# EasyEDA Pro project ProPrj_H750VB_2024-10-16.epro, schematic Schematic1
Board Name: Board1; Create Date: 2024-09-11
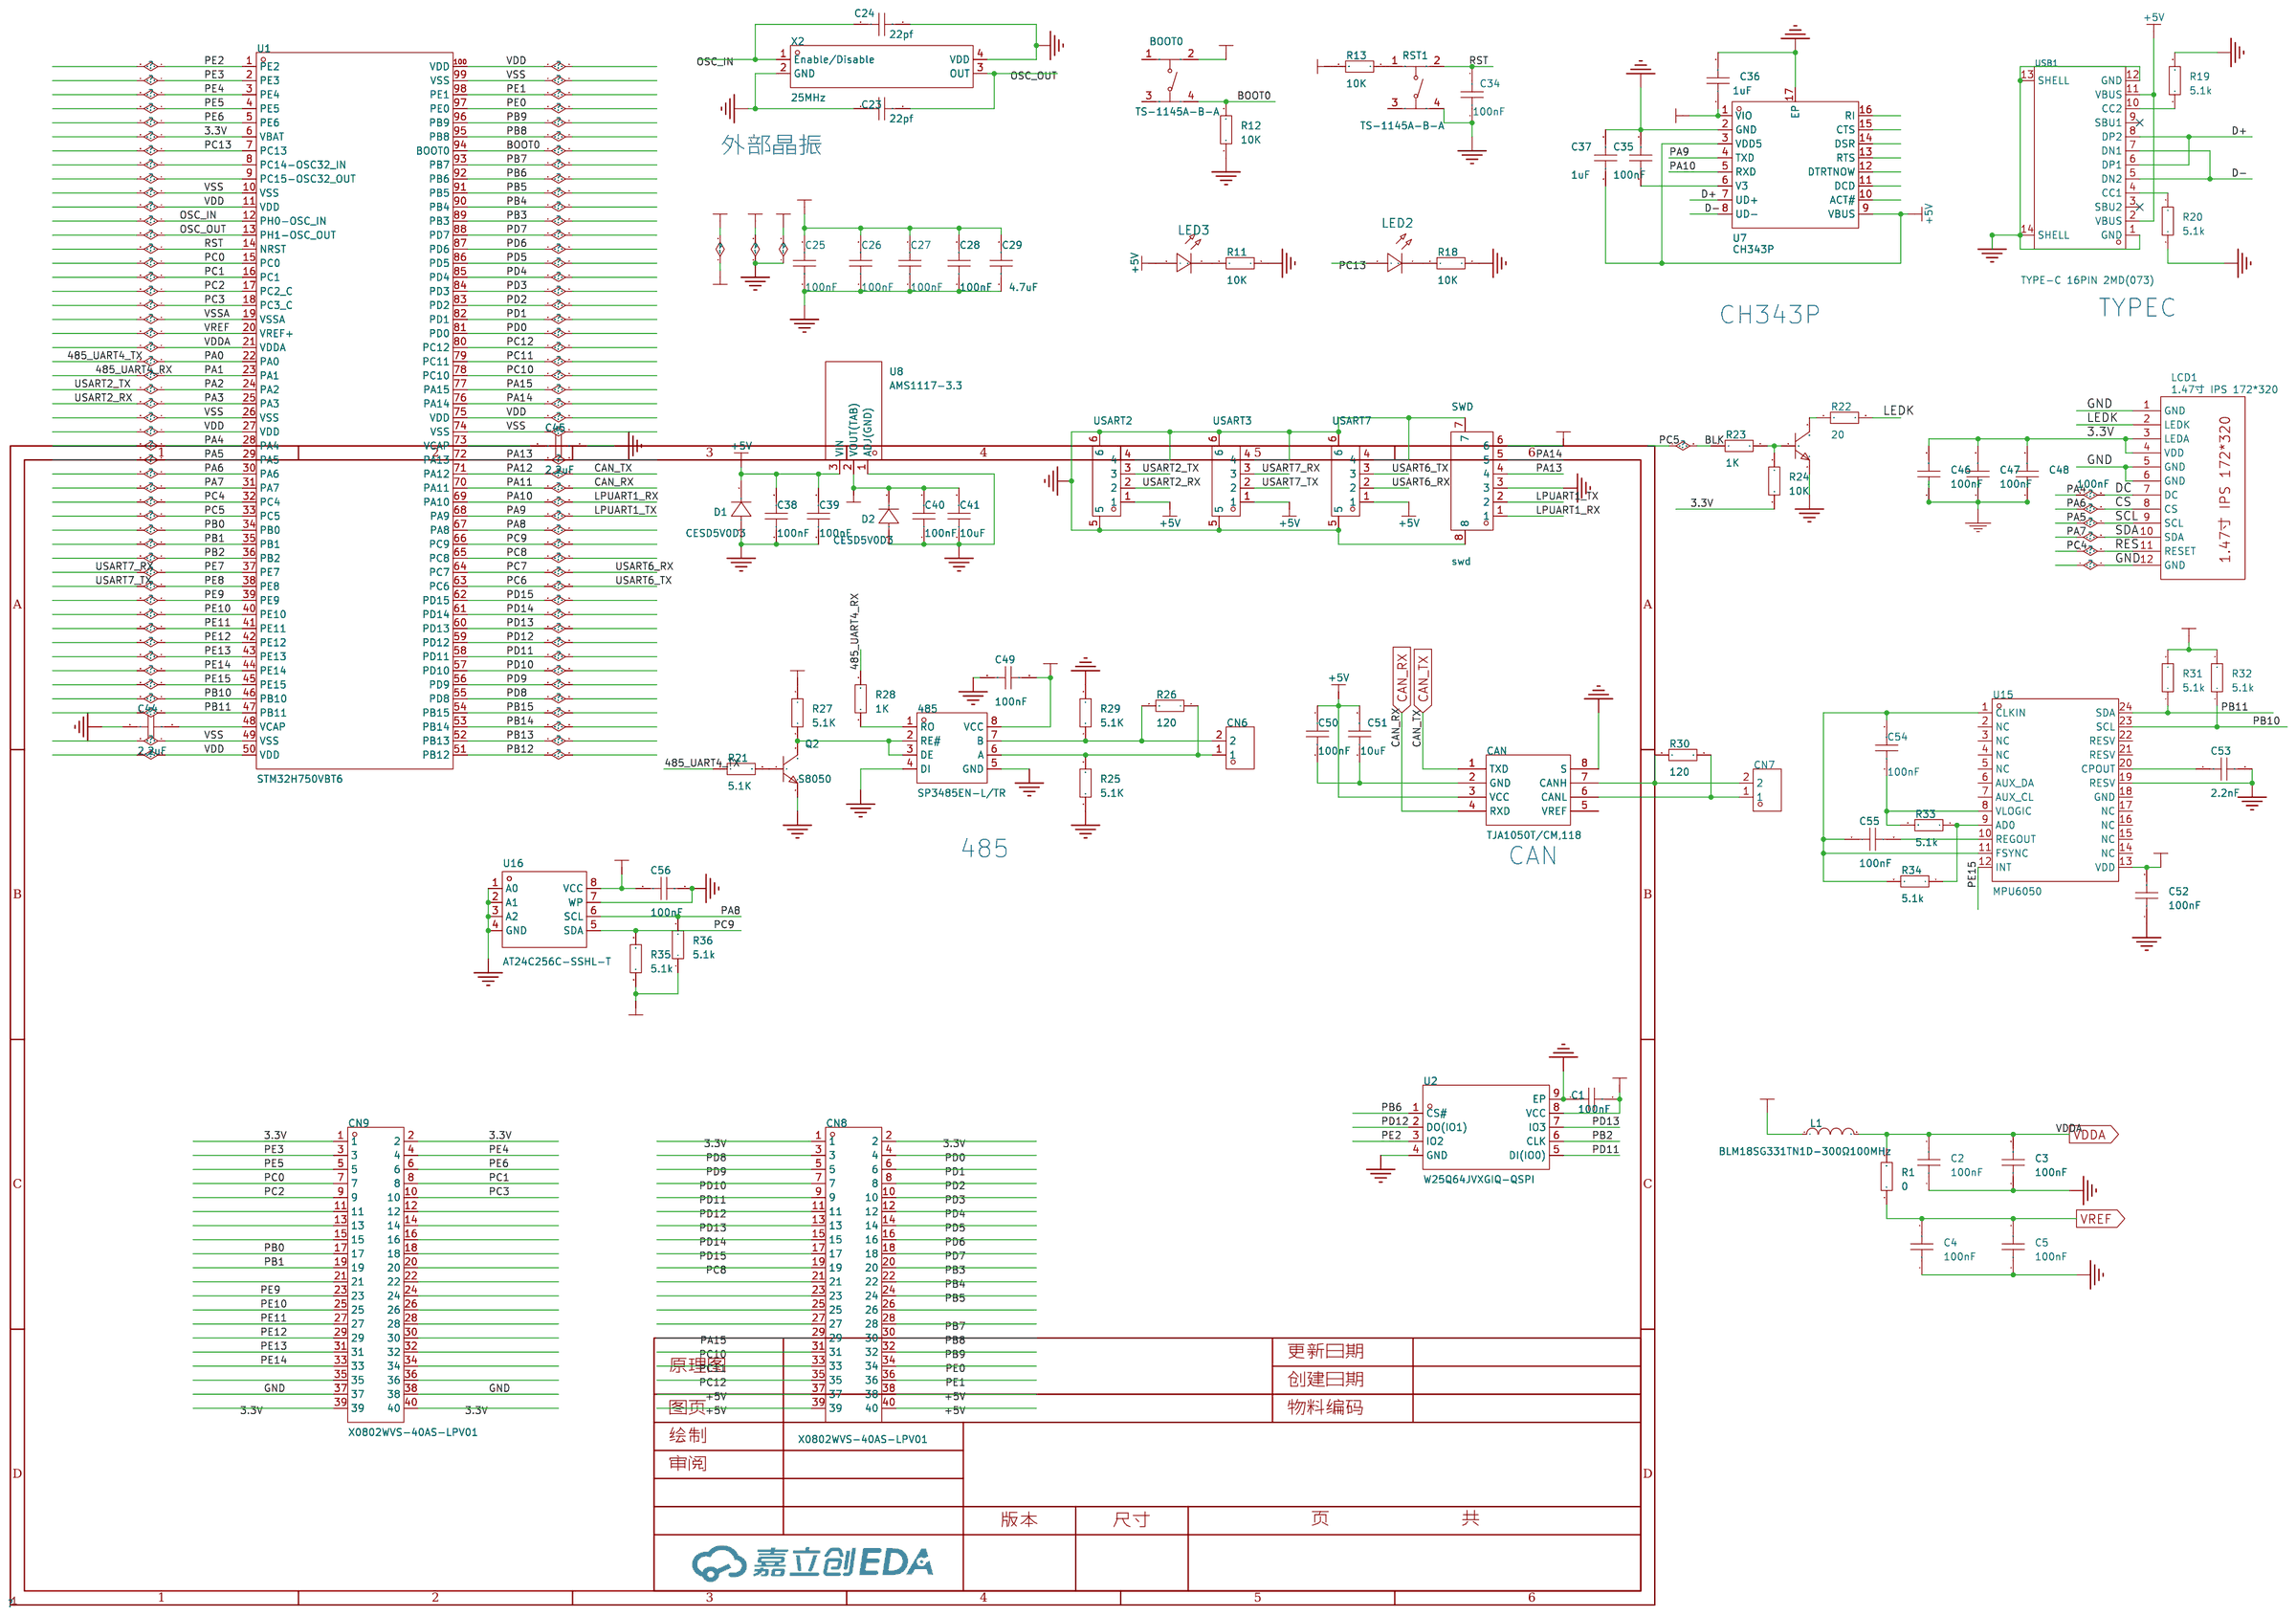
[diagram p0: schematic sheet]

## Parts
485  SP3485EN-L/TR  [SOIC-8_L5.0-W4.0-P1.27-LS6.0-BL]
BOOT0  TS-1145A-B-A  [SW-SMD_4P-L4.2-W3.2-P2.15-LS5.2]
C1  100nF  [C0603]
C2  100nF  [C0603]
C3  100nF  [C0603]
C4  100nF  [C0603]
C5  100nF  [C0603]
C23  22pf  [C0603]
C24  22pf  [C0603]
C25  100nF  [C0603]
C26  100nF  [C0603]
C27  100nF  [C0603]
C28  100nF  [C0603]
C29  4.7uF  [C0603]
C34  100nF  [C0603]
C35  100nF  [C0603]
C36  1uF  [C0603]
C37  1uF  [C0603]
C38  100nF  [C0603]
C39  100nF  [C0603]
C40  100nF  [C0603]
C41  10uF  [C0603]
C44  2.2uF  [C0603]
C45  2.2uF  [C0603]
C46  100nF  [C0603]
C47  100nF  [C0603]
C48  100nF  [C0603]
C49  100nF  [C0603]
C50  100nF  [C0603]
C51  10uF  [C0603]
C52  100nF  [C0603]
C53  2.2nF  [C0603]
C54  100nF  [C0603]
C55  100nF  [C0603]
C56  100nF  [C0603]
CAN  TJA1050T/CM,118  [SOIC-8_L5.0-W4.0-P1.27-LS6.0-BL]
CN6  ZX-XH2.54-2PZZ  [CONN-TH_2P-P2.50_HX25003-2A]
CN7  ZX-XH2.54-2PZZ  [CONN-TH_2P-P2.50_HX25003-2A]
CN8  X0802WVS-40AS-LPV01  [CONN-SMD_40P-P0.80_XKB_X0802WVS-40ADS-LPV01]
CN9  X0802WVS-40AS-LPV01  [CONN-SMD_40P-P0.80_XKB_X0802WVS-40ADS-LPV01]
D1  CESD5V0D3  [SOD-323_L1.7-W1.3-LS2.6-RD-2]
D2  CESD5V0D3  [SOD-323_L1.7-W1.3-LS2.6-RD-2]
L1  BLM18SG331TN1D-300Ω100MHz  [L0603]
LCD1  1.47寸 IPS 172*320  [1.47LCD-IPS-172*320-反面]
LED2  -  [LED_0603]
LED3  -  [LED_0603]
Q2  S8050  [SOT-23-3_L2.9-W1.6-P1.90-LS2.8-BR]
R1  0  [R0603]
R11  10K  [R0603]
R12  10K  [R0603]
R13  10K  [R0603]
R18  10K  [R0603]
R19  5.1k  [R0603]
R20  5.1k  [R0603]
R21  5.1K  [R0603]
R22  20  [R0603]
R23  1K  [R0603]
R24  10K  [R0603]
R25  5.1K  [R0603]
R26  120  [R0603]
R27  5.1K  [R0603]
R28  1K  [R0603]
R29  5.1K  [R0603]
R30  120  [R0603]
R31  5.1k  [R0603]
R32  5.1k  [R0603]
R33  5.1k  [R0603]
R34  5.1k  [R0603]
R35  5.1k  [R0603]
R36  5.1k  [R0603]
RST1  TS-1145A-B-A  [SW-SMD_4P-L4.2-W3.2-P2.15-LS5.2]
SWD  swd  [CONN-SMD_6P-P1.00_MEGASTAR_ZX-SH1.0-6PWT]
U1  STM32H750VBT6  [LQFP-100_L14.0-W14.0-P0.50-LS16.0-BL]
U2  W25Q64JVXGIQ-QSPI  [XSON-8_L4.0-W4.0-P0.80-TL-EP]
U7  CH343P  [TQFN-16_L3.0-W3.0-P0.50-BL-EP1.7]
U8  AMS1117-3.3  [SOT-89_L4.5-W2.5-P1.50-LS4.2-BR]
U9  SS8050  [SOT-23-3_L2.9-W1.3-P1.90-LS2.4-BR]
U15  MPU6050  [QFN-24_L4.0-W4.0-P0.50-BL]
U16  AT24C256C-SSHL-T  [SOIC-8_L4.9-W3.9-P1.27-LS6.0-BL]
USART2  WAFER-SH1.0-4PWB  [CONN-SMD_4P-P1.00_WAFER-SH1.0-4PWB]
USART3  WAFER-SH1.0-4PWB  [CONN-SMD_4P-P1.00_WAFER-SH1.0-4PWB]
USART7  WAFER-SH1.0-4PWB  [CONN-SMD_4P-P1.00_WAFER-SH1.0-4PWB]
USB1  TYPE-C 16PIN 2MD(073)  [USB-C-SMD_TYPE-C-6PIN-2MD-073]
X2  25MHz  [OSC-SMD_4P-L3.2-W2.5-BL]

## Library data of the parts
485 = SP3485EN-L/TR: 类型:收发器;数据速率:10Mbps;驱动器/接收器:1/1;; LCSC Part Name: 3.3V供电 10Mbps 收发器; Supplier Part: C8963; Manufacturer: MaxLinear(迈凌); Supplier Footprint: SOIC-8; JLCPCB Part Class: 基础库; Datasheet: https://atta.szlcsc.com/upload/public/pdf/source/20170601/1496285796963.pdf; Supplier: LCSC; Types: 收发器; Supply Voltage: 3.3V; Data Rate: 10Mbps; Driver/receiver: 1/1; Operating Temperature: -40℃~+85℃
BOOT0 RST1 = TS-1145A-B-A: 触点电流:50mA;额定电压(DC):12V;绝缘电阻:-;电路结构:单刀单掷;安装方式:立贴;带灯:无;作用力:160gf;机械寿命:10万次;带支架:否;; LCSC Part Name: 4.2*3.2*2.5mm 立贴 轻触开关; Supplier Part: C318904; Manufacturer: XKB Connectivity(中国星坤); Supplier Footprint: SMD; JLCPCB Part Class: 扩展库; Datasheet: https://atta.szlcsc.com/upload/public/pdf/source/20211011/FC00869C3CE33BCCD344D072F551E76B.pdf; Supplier: LCSC; Contact Current: 50mA; Voltage Rating (DC): 12V; Circuit: 单刀单掷; Mounting Style: 立贴; Actuator Style: 椭圆形按钮; Actuator/Cap Color: 白色; With Lamp: 无; Operating Force: 160gf; Mechanical Life: 10万次; Operating Temperature: -30℃~+85℃; Switch Length: 4.2mm; Switch Width: 3.2mm; Switch Height: 2.5mm; Strike Gundam: 否
C1-C5 C23-C29 C34-C41 C44-C56 = CAP_0603: Supplier Footprint: 0603
CAN = TJA1050T/CM,118: 类型:收发器;; LCSC Part Name: 4.75V~5.25V; Supplier Part: C6952; Manufacturer: NXP(恩智浦); Supplier Footprint: SOP-8; JLCPCB Part Class: 扩展库; Datasheet: https://atta.szlcsc.com/upload/public/pdf/source/20140411/1457707042917.pdf; Supplier: LCSC; Type: 收发器; Supply Voltage: 4.75V~5.25V; Supply Current: 50mA
CN6 CN7 = ZX-XH2.54-2PZZ: 插针结构:1x2P;间距:2.54mm;安装方式:直插;参考系列:XH;总PIN数:2P;排数:1;每排PIN数:2;行距:-;额定电流:3A;触头材质:黄铜;触头镀层:锡;工作温度范围:-25℃~+85℃;; Supplier Part: C7429632; Manufacturer: Megastar(兆星); Supplier Footprint: 插件,P=2.54mm; JLCPCB Part Class: 扩展库; Datasheet: https://atta.szlcsc.com/upload/public/pdf/source/20230619/19BA6947230AA44A04D3EDD65E618FD0.pdf; Supplier: LCSC; Pins Structure: 1x2P; Pitch: 2.54mm; Mounting Style: 直插; Reference Series: XH; Number of Pins: 2P; Number of Rows: 1; Number of PINs Per Row: 2; Current Rating (Max): 3A; Contact Material: 黄铜; Contact Plating: 锡; Operating Temperature Range: -25℃~+85℃
CN8 CN9 = X0802WVS-40AS-LPV01: PIN总数:40P;间距:0.8mm;公母:公;安装方式:立贴;行数:2;额定电流:500mA;工作温度范围:-25℃~+85℃;; LCSC Part Name: 间距:0.8mm PIN:40P 公 立贴; Supplier Part: C2925329; Manufacturer: XKB Connection(中国星坤); Supplier Footprint: SMD,P=0.8mm; JLCPCB Part Class: 扩展库; Datasheet: https://atta.szlcsc.com/upload/public/pdf/source/20211215/082FD9024D3D5655771ED54599ED55C7.pdf; Supplier: LCSC; Number of Pins: 40P; Pitch: 0.8mm; Gender: 公; Mounting Style: 立贴; Number of Rows: 2; Current Rating (Max): 500mA; Operating Temperature Range: -25℃~+85℃
D1 D2 = CESD5V0D3: Supplier Part: C2910104; Manufacturer: CJ(江苏长电/长晶); Supplier Footprint: SOD-323; JLCPCB Part Class: 扩展库; Datasheet: https://atta.szlcsc.com/upload/public/pdf/source/20211110/58BE480CB469CAFE3D9B18C12E558EBA.pdf; Supplier: LCSC; Type: ESD
L1 = BLM18SG331TN1D: 标称阻抗@测试频率:330Ω@100MHz;误差:±25%;直流电阻(RDC):70mΩ;; LCSC Part Name: 单路 0603磁珠 阻抗330Ω@100MHz; Supplier Part: C88989; Manufacturer: muRata(村田); Supplier Footprint: 0603; JLCPCB Part Class: 扩展库; Datasheet: https://atta.szlcsc.com/upload/public/pdf/source/20180329/C160981_FD3C2D2622A377E203B89F4AA32B0741.pdf; Supplier: LCSC; Impedance @ Frequency: 330Ω@100MHz; Tolerance: ±25%; DC Resistance: 70mΩ; Current Rating: 1.5A; Circuits: 1
LCD1 = 1.47寸 IPS 172*320
LED2 LED3 = LED_0603-R: Supplier Footprint: 0603
Q2 = S8050_C181158: 晶体管类型:NPN;集电极电流(Ic):500mA;集射极击穿电压(Vceo):25V;功率(Pd):300mW;; LCSC Part Name: NPN 电流:500mA 耐压:25V; Supplier Part: C181158; Manufacturer: Hottech(合科泰); Supplier Footprint: SOT-23; JLCPCB Part Class: 扩展库; Datasheet: https://atta.szlcsc.com/upload/public/pdf/source/20220506/D987F39D56F2975D34EC7947E75C4ABC.pdf; Supplier: LCSC; Transistor Type: NPN; Collector Current (Ic): 500mA; Collector-Emitter Breakdown Voltage (Vceo): 25V; Power Dissipation (Pd): 300mW; Transition Frequency (fT): 150MHz; Collector Cut-Off Current (Icbo): 100nA; Collector-Emitter Saturation Voltage (VCE(sat)@Ic,Ib): 600mV@500mA,50mA
R1 R11-R13 R18-R36 = Res_0603: Supplier Footprint: 0603
SWD = ZX-SH1.0-6PWT: 插针结构:1x6P;间距:1mm;安装方式:卧贴;参考系列:SH;总PIN数:6P;排数:1;每排PIN数:6;行距:-;额定电流:1A;触头材质:黄铜;触头镀层:锡;工作温度范围:-25℃~+85℃;; Supplier Part: C7430448; Manufacturer: Megastar(兆星); Supplier Footprint: SMD,P=1mm,卧贴; JLCPCB Part Class: 扩展库; Datasheet: https://atta.szlcsc.com/upload/public/pdf/source/20230619/677B156B919545DC550B043554513491.pdf; Supplier: LCSC; Pins Structure: 1x6P; Pitch: 1mm; Mounting Style: 卧贴; Reference Series: SH; Number of Pins: 6P; Number of Rows: 1; Number of PINs Per Row: 6; Current Rating (Max): 1A; Contact Material: 黄铜; Contact Plating: 锡; Operating Temperature Range: -25℃~+85℃
U1 = STM32H750VBT6: CPU内核:-;程序存储容量:128KB;RAM总容量:1MB;GPIO端口数量:82;工作电压范围:1.62V~3.6V;CPU最大主频:480MHz;程序存储器类型:FLASH;; LCSC Part Name: 带DSP和DP-FPU的高性能ARM Cortex-M7 MCU，具有128 KB Flash、1 MB RAM、480 MHz CPU、一级缓存、外部存储器接口、JPEG编解码器、硬件加密和大量外设; Supplier Part: C404010; Manufacturer: ST(意法半导体); Supplier Footprint: LQFP-100(14x14); JLCPCB Part Class: 扩展库; Datasheet: https://atta.szlcsc.com/upload/public/pdf/source/20231008/912982D4F3BD3DF1AA7D0A7EE6EF5B6B.pdf; Supplier: LCSC; Program Storage Size: 128KB; RAM Size: 1MB; GPIO Ports Number: 82; Operating Voltage Range: 1.62V~3.6V; CPU Maximum Speed: 480MHz; Program Memory Type: FLASH; Operating Temperature Range: -40℃~+85℃; ADC (Bit): 16bit; DAC (Bit): 12bit; Universal Serial Bus: 有; Peripheral/Function: DMA；LCD/LED驱动; Watchdog: 有; Infrared Data Association: 有; Low-Voltage Detect: 有; LCD Module: 有; Secure Digital Input and Output: 有; Direct Memory Access: 有; Internal Oscillator: 有
U2 = W25Q64JVXGIQ: Supplier Part: C2940195; Manufacturer: WINBOND(华邦); Supplier Footprint: XSON-8-EP(4x4); JLCPCB Part Class: 扩展库; Datasheet: https://atta.szlcsc.com/upload/public/pdf/source/20220111/96C134BA110DAC08742B3CB6C4519B4C.pdf; Supplier: LCSC
U7 = CH343P: 应用功能:-;接口协议:-;; Supplier Part: C2846043; Manufacturer: WCH(南京沁恒); Supplier Footprint: TQFN-16-EP(3x3); JLCPCB Part Class: 扩展库; Datasheet: https://atta.szlcsc.com/upload/public/pdf/source/20211010/C2846043_7FA705E1F14A2906F6A2AFA45FA28209.pdf; Supplier: LCSC
U8 = AMS1117-3.3_C347256: 输出类型:固定;最大输入电压:12V;输出电压:3.3V;最大输出电流:1A;电源纹波抑制比(PSRR):60dB@(120Hz);输出极性:正极;; LCSC Part Name: 输出:3.3V 电流:1A 耐压:12V; Supplier Part: C347256; Manufacturer: UMW(友台半导体); Supplier Footprint: SOT-89; JLCPCB Part Class: 扩展库; Datasheet: https://atta.szlcsc.com/upload/public/pdf/source/20231109/155D79A26D9DB04352555A58D5969DC8.pdf; Supplier: LCSC; Output Type: 固定; Maximum Input Voltage: 12V; Output Voltage: 3.3V; MAX Output Current: 1A; Power Supply Rejection Ratio (PSRR): 60dB@(120Hz); Dropout Voltage: 1.3V@(1A); Output Polarity: 正极; Number of Outputs: 1
U9 = SS8050_C7420370: 晶体管类型:NPN;集电极电流(Ic):1.5A;集射极击穿电压(Vceo):25V;功率(Pd):300mW;直流电流增益(hFE@Ic,Vce):120@100mA,1.0V;; LCSC Part Name: 耐压:25V 电流:1.5A NPN H档 200-350; Supplier Part: C7420370; Manufacturer: 宏迦橙; Supplier Footprint: SOT-23; JLCPCB Part Class: 扩展库; Datasheet: https://atta.szlcsc.com/upload/public/pdf/source/20231222/9C4050A7669EB24B3ACD0418218817FD.pdf; Supplier: LCSC; Transistor Type: NPN; Collector Current (Ic): 1.5A; Collector-Emitter Breakdown Voltage (Vceo): 25V; Power Dissipation (Pd): 300mW; DC Current Gain (hFE@Ic,Vce): 120@100mA,1.0V; Transition Frequency (fT): 100MHz; Collector Cut-Off Current (Icbo): 100nA; Collector-Emitter Saturation Voltage (VCE(sat)@Ic,Ib): 500mV@800mA,80mA; Operating Temperature: -55℃~+150℃
U15 = MPU6050: Supplier Part: C9900042518; Supplier Footprint: QFN-24_L4.0-W4.0-P0.50-BL-EP2.7; Supplier: LCSC
U16 = AT24C256C-SSHL-T: 接口类型:I2C;存储容量:256Kbit;; Supplier Part: C6482; Manufacturer: MICROCHIP(美国微芯); Supplier Footprint: SOIC-8; JLCPCB Part Class: 扩展库; Datasheet: https://atta.szlcsc.com/upload/public/pdf/source/20140704/1457707098744.pdf; Supplier: LCSC; Interface Type: I2C; Memory Size: 256Kbit; Supply Voltage: 1.7V~5.5V; Operating Temperature: -40℃~+85℃
USART2 USART3 USART7 = WAFER-SH1.0-4PWB: 插针结构:1x4P;间距:1mm;安装方式:卧贴;总PIN数:4P;排数:1;每排PIN数:4;额定电流:1A;工作温度范围:-25℃~+85℃;; LCSC Part Name: 1x4P 间距:1mm 卧贴; Supplier Part: C3029343; Manufacturer: XUNPU(讯普); Supplier Footprint: SMD,P=1mm,卧贴; JLCPCB Part Class: 扩展库; Datasheet: https://atta.szlcsc.com/upload/public/pdf/source/20220527/1879B8210BD3B2006BCEAC1A40D397B6.pdf; Supplier: LCSC; Pins Structure: 1x4P; Pitch: 1mm; Mounting Style: 卧贴; Number of Pins: 4P; Number of Rows: 1; Number of PINs Per Row: 4; Current Rating (Max): 1A; Operating Temperature Range: -25℃~+85℃
USB1 = TYPE-C 16PIN 2MD(073): 连接器类型:Type-C;标准:-;公母:母座;触点数量:16;端口数量:1;安装方式:卧贴;额定电流 - 电源:5A;工作温度范围:-25℃~+85℃;; LCSC Part Name: TYPE-C母座 16P 4脚插件带定位柱 不锈钢外壳 2次模顶; Supplier Part: C2765186; Manufacturer: SHOU HAN(首韩); Supplier Footprint: SMD; JLCPCB Part Class: 扩展库; Supplier: LCSC; Connector Type: Type-C; Gender: 母座; Number of Contacts: 16; Number of Ports: 1; Mounting Style: 卧贴; Current Rating - Power (Max): 5A; Operating Temperature Range: -25℃~+85℃
X2 = OT322525MJBA4SL: 频率:25MHz;工作电压:1.8V~3.3V;供电电流:5mA;频率稳定度(全温):±10ppm;; LCSC Part Name: 25MHz ±10ppm 1.8V~3.3V YSO110TR; Supplier Part: C669088; Manufacturer: YXC(扬兴晶振); Supplier Footprint: SMD3225-4P; JLCPCB Part Class: 扩展库; Datasheet: https://atta.szlcsc.com/upload/public/pdf/source/20210329/C669065_30B18CFE780D377BA4E84F6ED1951959.pdf; Supplier: LCSC; Supply Voltage: 1.8V~3.3V; Supply Current (Max): 5mA; Frequency Stability(Full temperature range): ±10ppm; Operating Temperature: -40℃~+85℃

## Nets
3.3V: 485.8(VCC) BOOT0.2 C1.2 C25.2 C26.2 C27.2 C28.2 C29.2 C36.1 C40.2 C41.2 C46.2 C47.2 C48.2 C49.1 C52.2 C56.2 CN8.1 CN8.2 CN9.1 CN9.2 CN9.39 CN9.40 D2.1(K) L1.1 LCD1.3(LEDA) LCD1.4(VDD) R13.2 R24.1 R27.1 R31.2 R32.2 R35.1 R36.1 SWD.6 U1.6(VBAT) U1.11(VDD) U1.27(VDD) U1.50(VDD) U1.75(VDD) U1.100(VDD) U2.8(VCC) U7.1(VIO) U8.2(VOUT(TAB)) U15.13(VDD) U16.8(VCC)
+5V: C37.1 C38.2 C39.2 C50.1 C51.2 CAN.3(VCC) CN8.37 CN8.38 CN8.39 CN8.40 D1.1(K) LED3.2(A) U7.3(VDD5) U7.9(VBUS) U8.3(VIN) USART2.1 USART3.1 USART7.1 USB1.2(VBUS) USB1.11(VBUS)
GND: 485.4(DI) 485.5(GND) C1.1 C2.1 C3.1 C4.1 C5.1 C23.1 C24.1 C25.1 C26.1 C27.1 C28.1 C29.1 C34.1 C35.2 C36.2 C37.2 C38.1 C39.1 C40.1 C41.1 C44.1 C45.1 C46.1 C47.1 C48.1 C49.2 C52.1 C53.2 C56.1 CAN.8(S) CN9.37 CN9.38 D1.2(A) D2.2(A) LCD1.1(GND) LCD1.5(GND) LCD1.6(GND) LCD1.12(GND) Q2.2 R11.1 R12.1 R18.1 R19.2 R20.1 R25.1 R29.2 RST1.4 SWD.3 SWD.7 SWD.8 U1.10(VSS) U1.19(VSSA) U1.26(VSS) U1.49(VSS) U1.74(VSS) U1.99(VSS) U2.4(GND) U2.9(EP) U7.2(GND) U7.17(EP) U8.1(ADJ(GND)) U9.2(E) U15.19(RESV) U16.1(A0) U16.2(A1) U16.3(A2) U16.4(GND) U16.7(WP) USART2.4 USART2.5 USART2.6 USART3.4 USART3.5 USART3.6 USART7.4 USART7.5 USART7.6 USB1.1(GND) USB1.12(GND) USB1.13(SHELL) USB1.14(SHELL) X2.2(GND) X2.4(VDD)
VDDA: C2.2 C3.2 L1.2 R1.2 U1.21(VDDA)
485_UART4_RX: R28.2 U1.23(PA1)
485_UART4_TX: R21.2 U1.22(PA0)
BLK: R23.1 U1.33(PC5)
BOOT0: BOOT0.4 R12.2 U1.94(BOOT0)
CAN_RX: CAN.4(RXD) U1.70(PA11)
CAN_TX: CAN.1(TXD) U1.71(PA12)
CS: LCD1.8(CS) U1.30(PA6)
D+: U7.7(UD+) USB1.6(DP1) USB1.8(DP2)
D-: U7.8(UD-) USB1.5(DN2) USB1.7(DN1)
DC: LCD1.7(DC) U1.28(PA4)
LEDK: LCD1.2(LEDK) R22.2
LPUART1_RX: SWD.1 U1.69(PA10) U7.5(RXD)
LPUART1_TX: SWD.2 U1.68(PA9) U7.4(TXD)
OSC_IN: C24.2 U1.12(PH0-OSC_IN) X2.1(Enable/Disable)
OSC_OUT: C23.2 U1.13(PH1-OSC_OUT) X2.3(OUT)
PA2: U1.24(PA2) USART2.3
PA3: U1.25(PA3) USART2.2
PA5: LCD1.9(SCL) U1.29(PA5)
PA7: LCD1.10(SDA) U1.31(PA7)
PA8: R36.2 U1.67(PA8) U16.6(SCL)
PA13: SWD.4 U1.72(PA13)
PA14: SWD.5 U1.76(PA14)
PA15: CN8.29 U1.77(PA15)
PB0: CN9.17 U1.34(PB0)
PB1: CN9.19 U1.35(PB1)
PB2: U1.36(PB2) U2.6(CLK)
PB3: CN8.20 U1.89(PB3)
PB4: CN8.22 U1.90(PB4)
PB5: CN8.24 U1.91(PB5)
PB6: U1.92(PB6) U2.1(CS#)
PB7: CN8.28 U1.93(PB7)
PB8: CN8.30 U1.95(PB8)
PB9: CN8.32 U1.96(PB9)
PB10: R32.1 U1.46(PB10) U15.23(SCL)
PB11: R31.1 U1.47(PB11) U15.24(SDA)
PB12: U1.51(PB12)
PB13: U1.52(PB13)
PB14: U1.53(PB14)
PB15: U1.54(PB15)
PC0: CN9.7 U1.15(PC0)
PC1: CN9.8 U1.16(PC1)
PC2: CN9.9 U1.17(PC2_C)
PC3: CN9.10 U1.18(PC3_C)
PC4: LCD1.11(RESET) U1.32(PC4)
PC6: U1.63(PC6) USART7.3
PC7: U1.64(PC7) USART7.2
PC8: CN8.19 U1.65(PC8)
PC9: R35.2 U1.66(PC9) U16.5(SDA)
PC10: CN8.31 U1.78(PC10)
PC11: CN8.33 U1.79(PC11)
PC12: CN8.35 U1.80(PC12)
PC13: LED2.2(A) U1.7(PC13)
PD0: CN8.4 U1.81(PD0)
PD1: CN8.6 U1.82(PD1)
PD2: CN8.8 U1.83(PD2)
PD3: CN8.10 U1.84(PD3)
PD4: CN8.12 U1.85(PD4)
PD5: CN8.14 U1.86(PD5)
PD6: CN8.16 U1.87(PD6)
PD7: CN8.18 U1.88(PD7)
PD8: CN8.3 U1.55(PD8)
PD9: CN8.5 U1.56(PD9)
PD10: CN8.7 U1.57(PD10)
PD11: CN8.9 U1.58(PD11) U2.5(DI(IO0))
PD12: CN8.11 U1.59(PD12) U2.2(DO(IO1))
PD13: CN8.13 U1.60(PD13) U2.7(IO3)
PD14: CN8.15 U1.61(PD14)
PD15: CN8.17 U1.62(PD15)
PE0: CN8.34 U1.97(PE0)
PE1: CN8.36 U1.98(PE1)
PE2: U1.1(PE2) U2.3(IO2)
PE3: CN9.3 U1.2(PE3)
PE4: CN9.4 U1.3(PE4)
PE5: CN9.5 U1.4(PE5)
PE6: CN9.6 U1.5(PE6)
PE7: U1.37(PE7) USART3.3
PE8: U1.38(PE8) USART3.2
PE9: CN9.23 U1.39(PE9)
PE10: CN9.25 U1.40(PE10)
PE11: CN9.27 U1.41(PE11)
PE12: CN9.29 U1.42(PE12)
PE13: CN9.31 U1.43(PE13)
PE14: CN9.33 U1.44(PE14)
PE15: U1.45(PE15) U15.12(INT)
RST: C34.2 RST1.2 U1.14(NRST)
VREF: C4.2 C5.2 R1.1 U1.20(VREF+)
$1N918: C45.2 U1.73(VCAP)
$1N1054: C44.2 U1.48(VCAP)
$1N2797: R20.2 USB1.4(CC1)
$1N2798: R19.1 USB1.10(CC2)
$1N3550: R13.1 RST1.1
$1N3557: LED2.1(C) R18.2
$1N3560: LED3.1(C) R11.2
$1N8893: R23.2 R24.2 U9.1(B)
$1N8978: R22.1 U9.3(C)
$1N9785: 485.1(RO) R28.1
$1N9790: 485.7(B) CN6.2 R26.2 R29.1
$1N9792: 485.6(A) CN6.1 R25.2 R26.1
$1N9796: 485.2(RE#) 485.3(DE) Q2.3 R27.2
$1N9798: Q2.1 R21.1
$1N10023: C50.2 C51.1 CAN.2(GND)
$1N10026: CAN.7(CANH) CN7.2 R30.2
$1N10028: CAN.6(CANL) CN7.1 R30.1
$1N15655: C53.1 U15.20(CPOUT)
$1N16049: C54.2 C55.1 R34.2 U15.1(CLKIN) U15.11(FSYNC)
$1N16103: R33.1 R34.1 U15.9(AD0)
$1N16107: C54.1 R33.2 U15.8(VLOGIC)
$1N16237: C55.2 U15.10(REGOUT)
Net-(C35-1): C35.1 U7.6(V3)

Not connected (* = marked no-connect by the designer): BOOT0 1 3; CAN 5(VREF); CN8 21 23 25 26 27; CN9 11 12 13 14 15 16 18 20 21 22 24 26 28 30 32 34 35 36; RST1 3; U1 8(PC14-OSC32_IN) 9(PC15-OSC32_OUT); U7 10(ACT#) 11(DCD) 12(DTRTNOW) 13(RTS) 14(DSR) 15(CTS) 16(RI); U15 2(NC) 3(NC) 4(NC) 5(NC) 6(AUX_DA) 7(AUX_CL) 14(NC) 15(NC) 16(NC) 17(NC) 18(GND) 21(RESV) 22(RESV); USB1 3(SBU2)* 9(SBU1)*

## Notes on the sheet
- 外部晶振
- CH343P
- TYPEC
- 485
- CAN
